# EAGLE design mason (EAGLE 5.10)
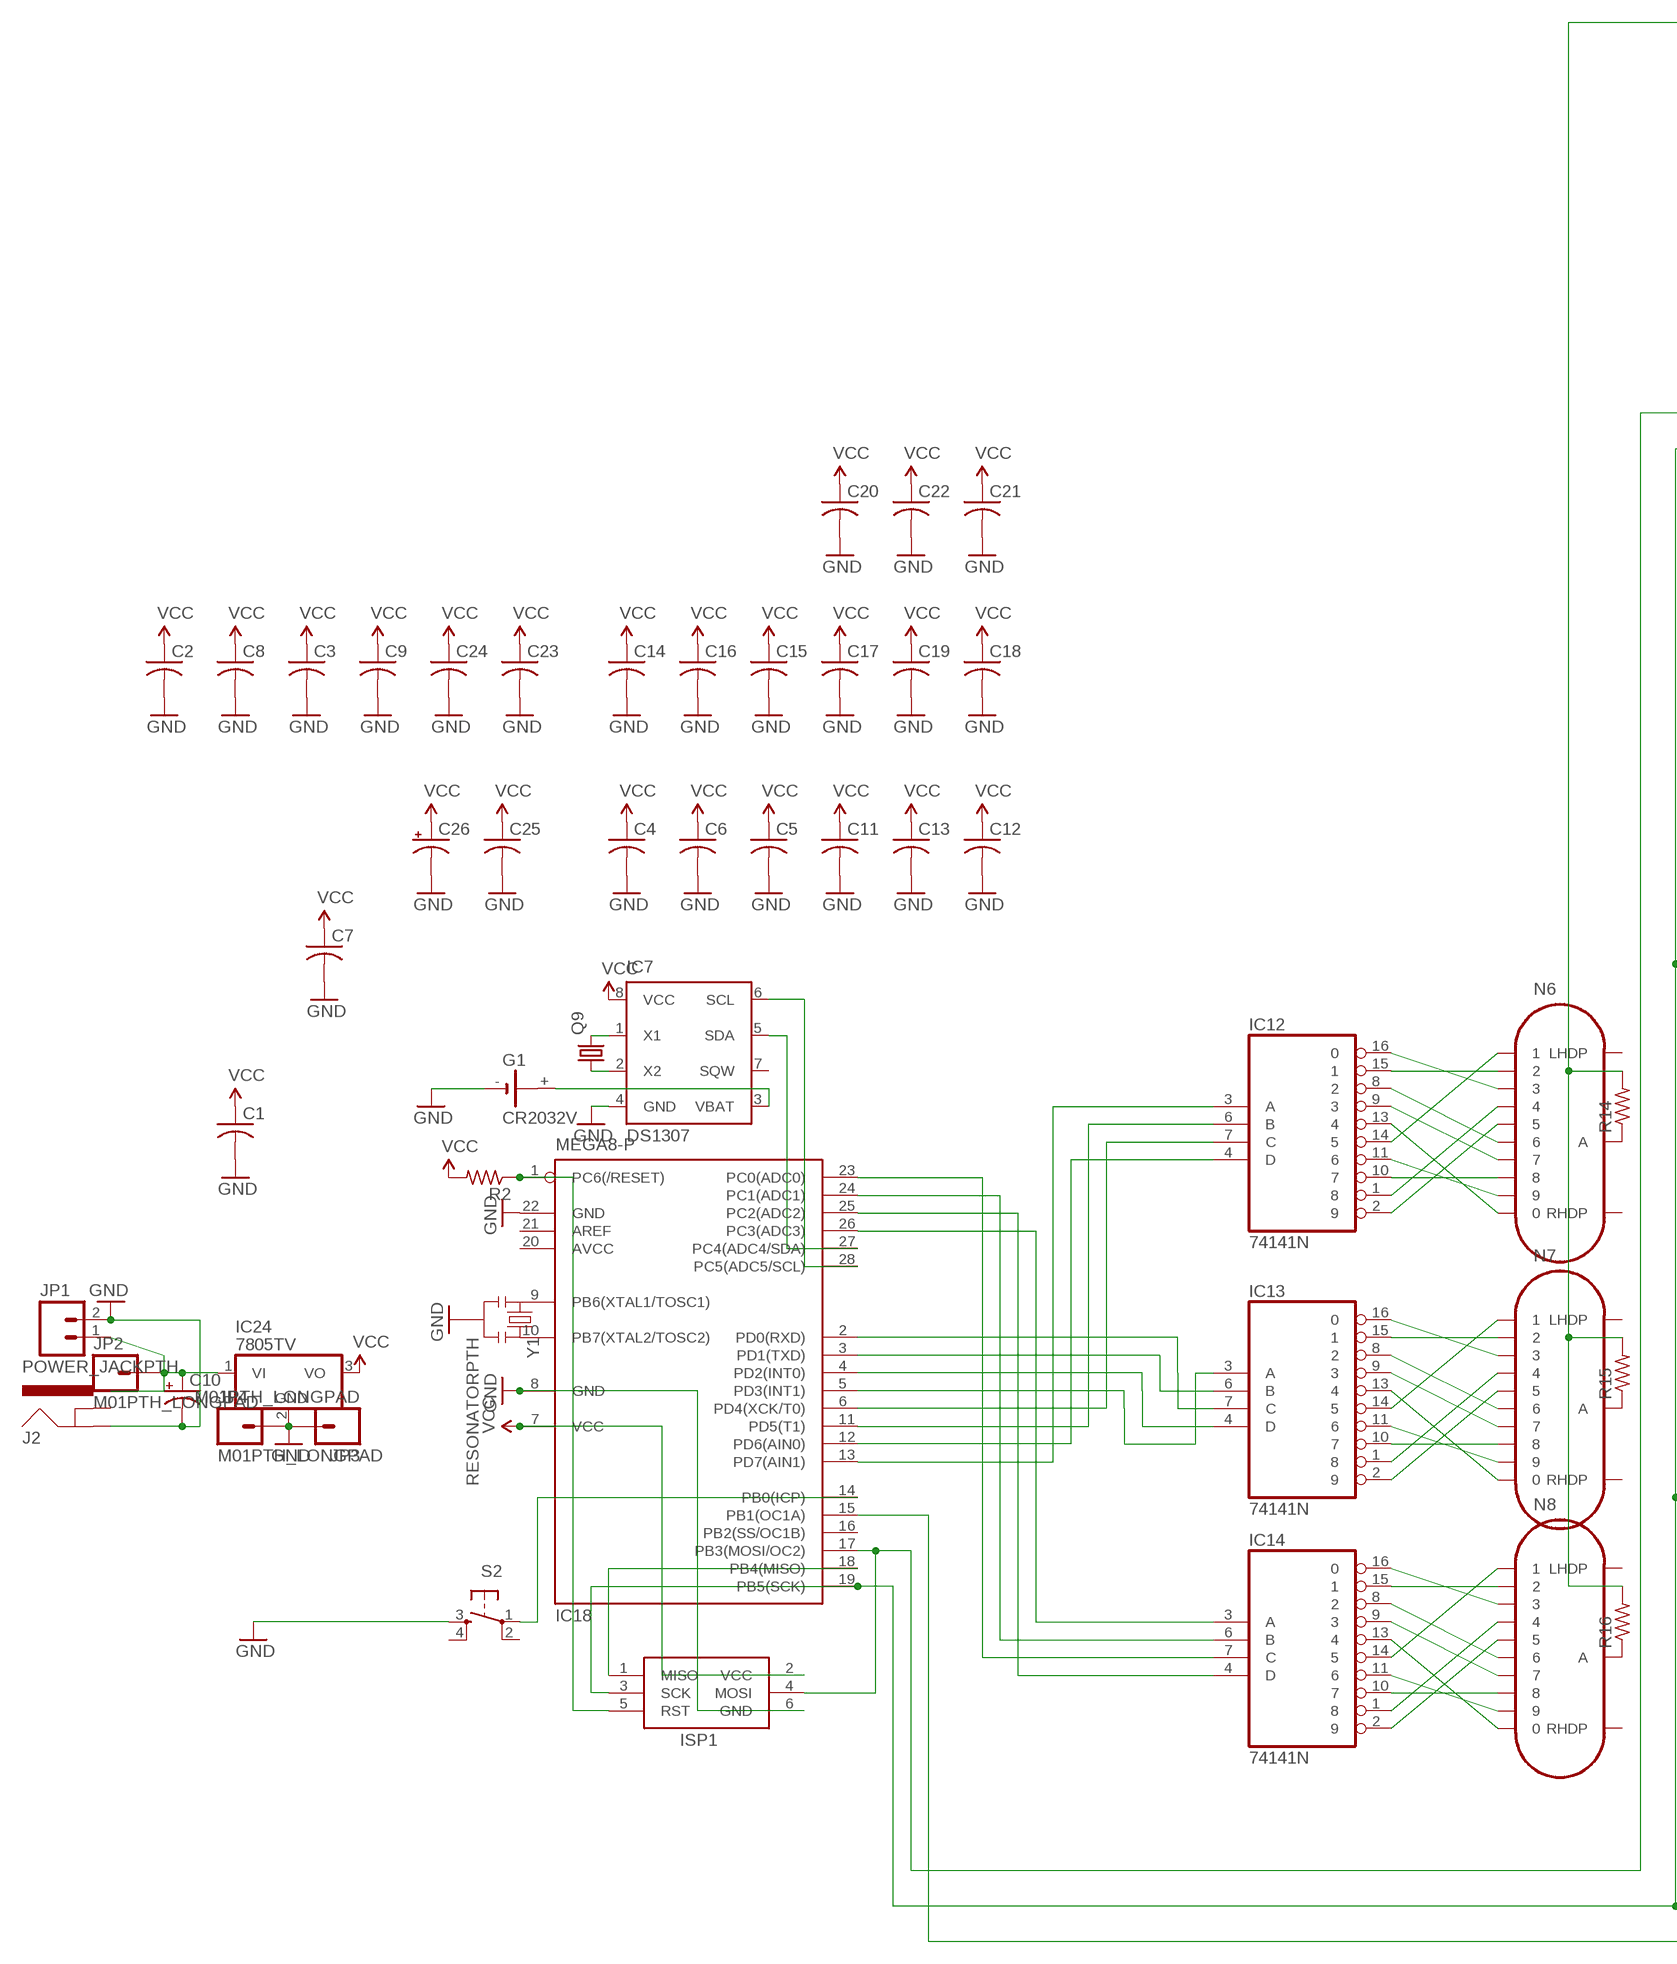
[diagram p0: schematic, sheet 1, part 1 of 2]
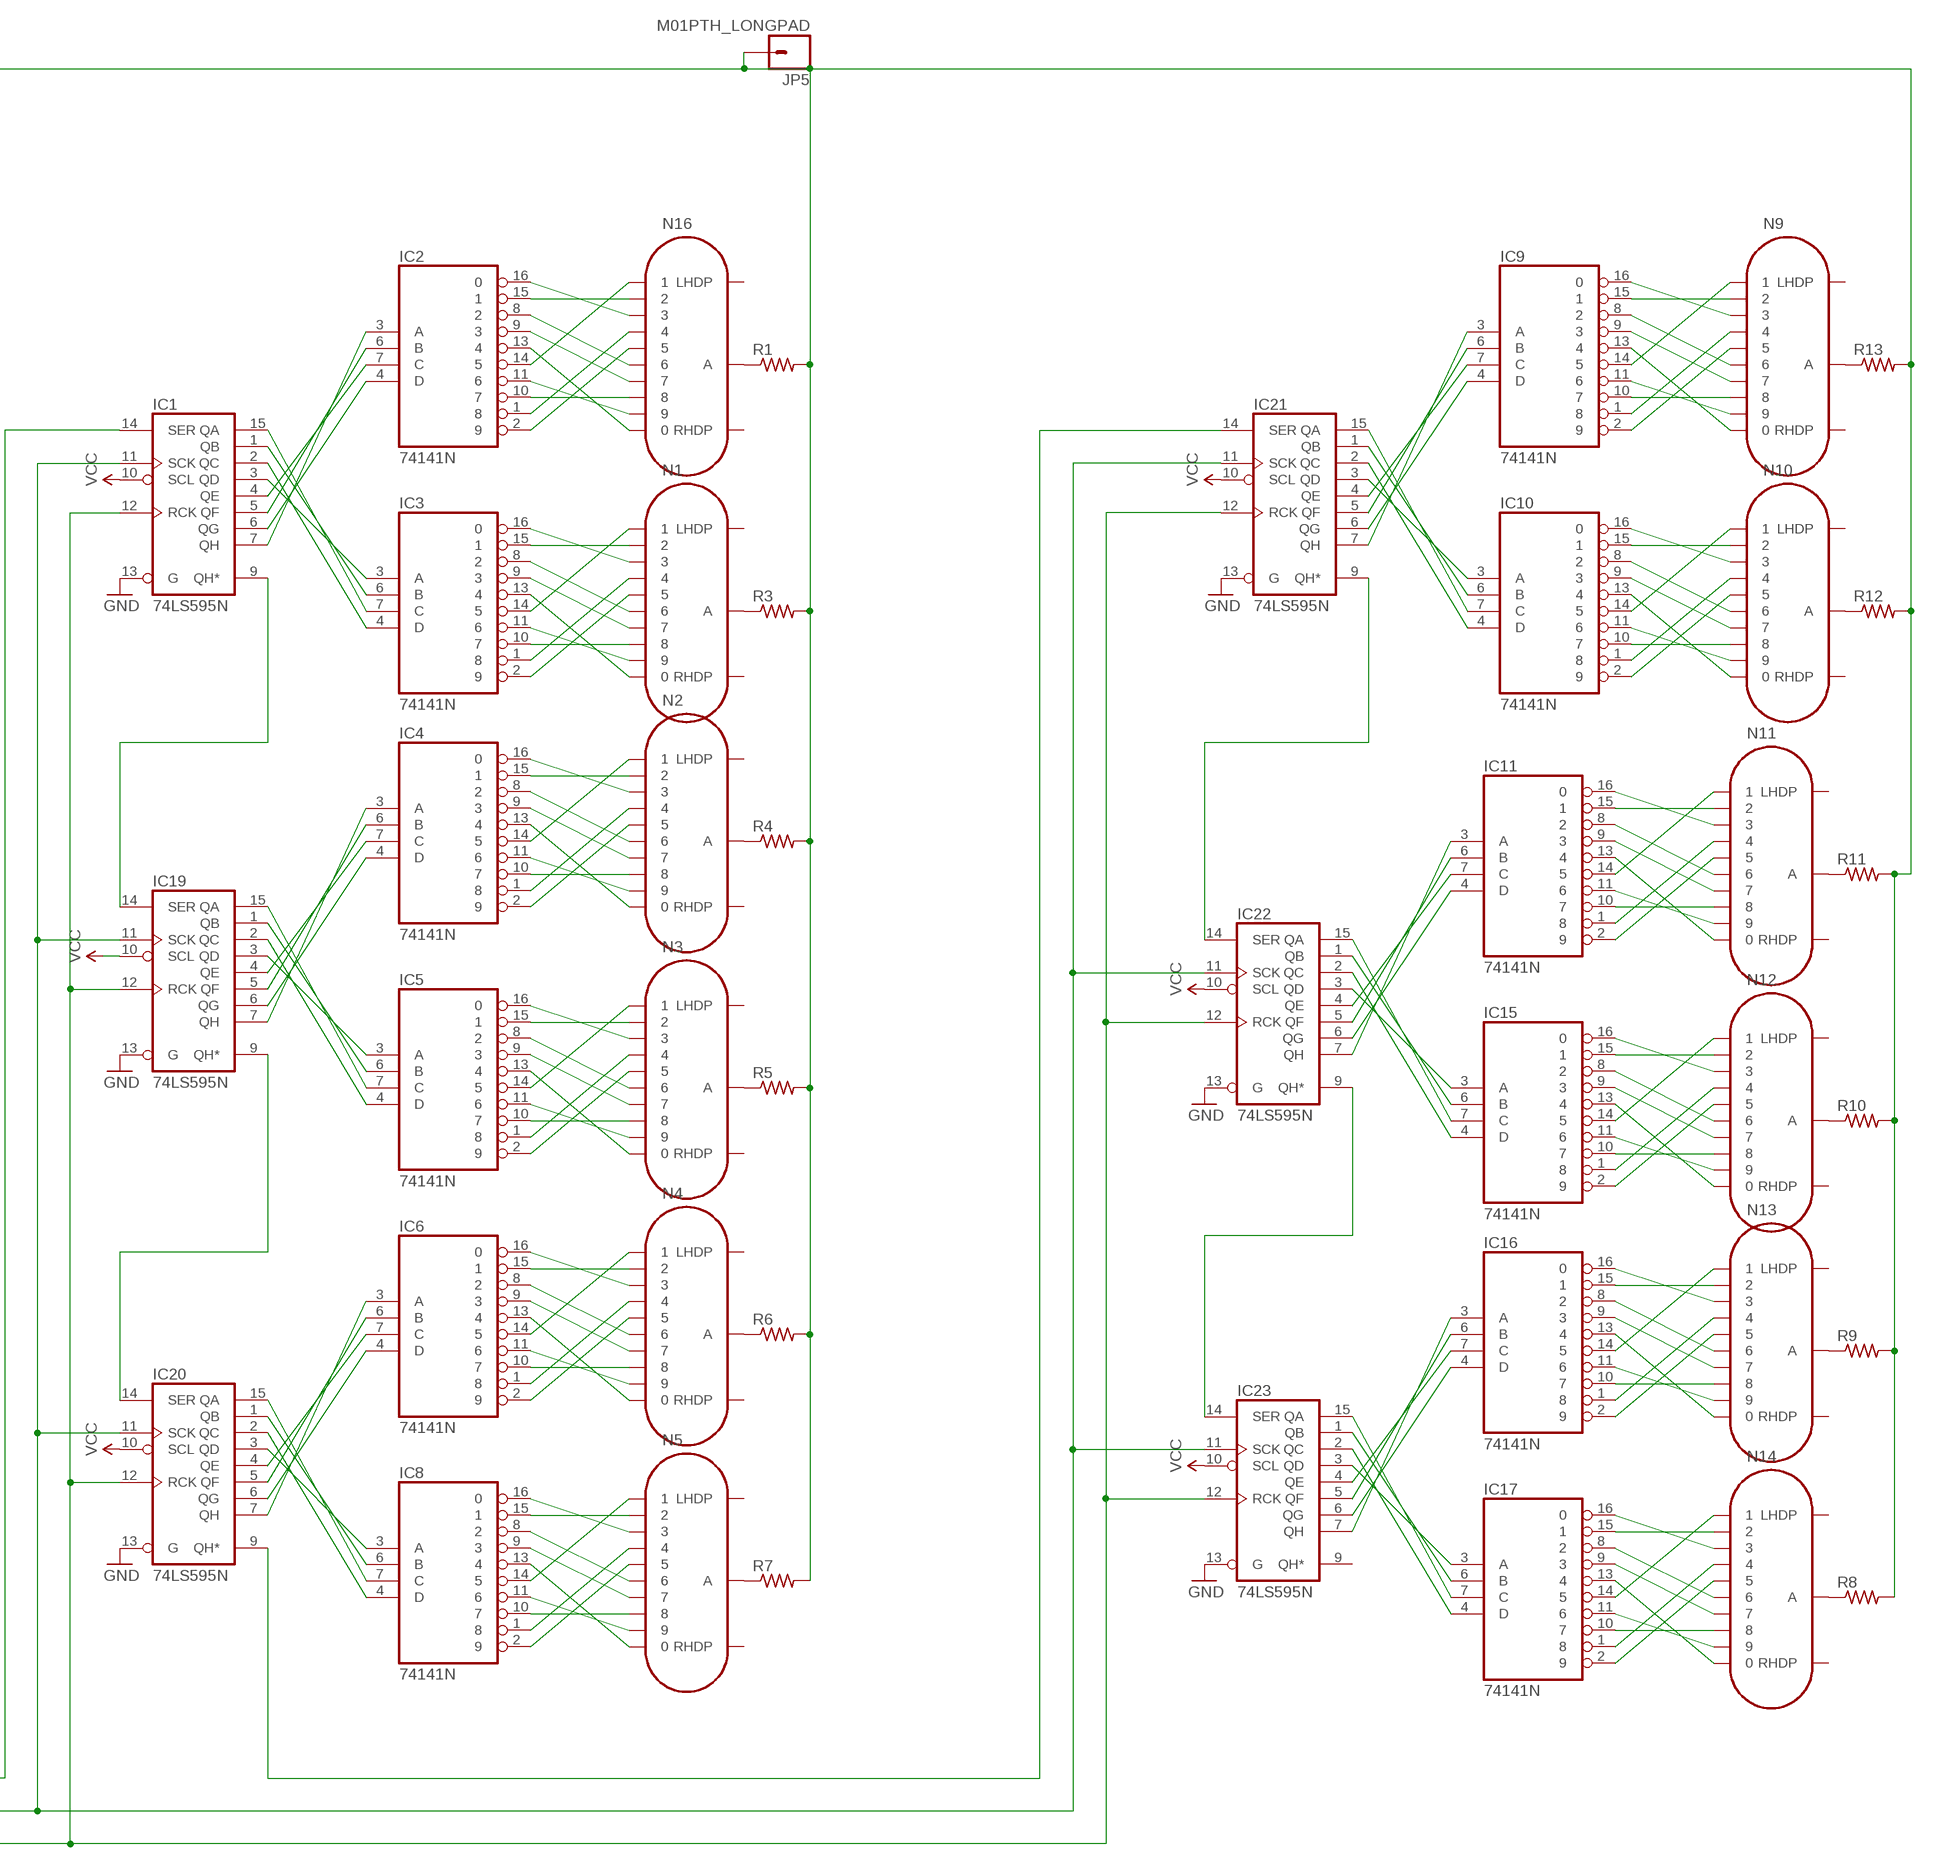
[diagram p1: schematic, sheet 1, part 2 of 2]

## Parts
C1  C-US025-025X050  [C025-025X050]
C2  C-US025-025X050  [C025-025X050]
C3  C-US025-025X050  [C025-025X050]
C4  C-US025-025X050  [C025-025X050]
C5  C-US025-025X050  [C025-025X050]
C6  C-US025-025X050  [C025-025X050]
C7  C-US025-025X050  [C025-025X050]
C8  C-US025-025X050  [C025-025X050]
C9  C-US025-025X050  [C025-025X050]
C10  CPOL-USE3.5-8  [E3,5-8]
C11  C-US025-025X050  [C025-025X050]
C12  C-US025-025X050  [C025-025X050]
C13  C-US025-025X050  [C025-025X050]
C14  C-US025-025X050  [C025-025X050]
C15  C-US025-025X050  [C025-025X050]
C16  C-US025-025X050  [C025-025X050]
C17  C-US025-025X050  [C025-025X050]
C18  C-US025-025X050  [C025-025X050]
C19  C-US025-025X050  [C025-025X050]
C20  C-US025-025X050  [C025-025X050]
C21  C-US025-025X050  [C025-025X050]
C22  C-US025-025X050  [C025-025X050]
C23  C-US025-025X050  [C025-025X050]
C24  C-US025-025X050  [C025-025X050]
C25  C-US025-025X050  [C025-025X050]
C26  CPOL-USE3.5-8  [E3,5-8]
G1  CR2032V  [CR2032V]
IC1  74LS595N  [DIL16]
IC2  74141N  [DIL16]
IC3  74141N  [DIL16]
IC4  74141N  [DIL16]
IC5  74141N  [DIL16]
IC6  74141N  [DIL16]
IC7  DS1307  [DIL08]
IC8  74141N  [DIL16]
IC9  74141N  [DIL16]
IC10  74141N  [DIL16]
IC11  74141N  [DIL16]
IC12  74141N  [DIL16]
IC13  74141N  [DIL16]
IC14  74141N  [DIL16]
IC15  74141N  [DIL16]
IC16  74141N  [DIL16]
IC17  74141N  [DIL16]
IC18  MEGA8-P  [DIL28-3]
IC19  74LS595N  [DIL16]
IC20  74LS595N  [DIL16]
IC21  74LS595N  [DIL16]
IC22  74LS595N  [DIL16]
IC23  74LS595N  [DIL16]
IC24  7805TV  [TO220V]
ISP1  AVRISP-6  [AVRISP]
J2  POWER_JACKPTH  [POWER_JACK_PTH]
JP1  M02  [1X02_LONGPADS]
JP2  M01PTH_LONGPAD  [1X01_LONGPAD]
JP3  M01PTH_LONGPAD  [1X01_LONGPAD]
JP4  M01PTH_LONGPAD  [1X01_LONGPAD]
JP5  M01PTH_LONGPAD  [1X01_LONGPAD]
N1  IN-14  [IN-14]
N2  IN-14  [IN-14]
N3  IN-14  [IN-14]
N4  IN-14  [IN-14]
N5  IN-14  [IN-14]
N6  IN-14  [IN-14]
N7  IN-14  [IN-14]
N8  IN-14  [IN-14]
N9  IN-14  [IN-14]
N10  IN-14  [IN-14]
N11  IN-14  [IN-14]
N12  IN-14  [IN-14]
N13  IN-14  [IN-14]
N14  IN-14  [IN-14]
N16  IN-14  [IN-14]
Q9  CRYSTALTC26H  [TC26H]
R1  R-US_0309/12  [0309/12]
R2  R-US_0204/5  [0204/5]
R3  R-US_0309/12  [0309/12]
R4  R-US_0309/12  [0309/12]
R5  R-US_0309/12  [0309/12]
R6  R-US_0309/12  [0309/12]
R7  R-US_0309/12  [0309/12]
R8  R-US_0309/12  [0309/12]
R9  R-US_0309/12  [0309/12]
R10  R-US_0309/12  [0309/12]
R11  R-US_0309/12  [0309/12]
R12  R-US_0309/12  [0309/12]
R13  R-US_0309/12  [0309/12]
R14  R-US_0309/12  [0309/12]
R15  R-US_0309/12  [0309/12]
R16  R-US_0309/12  [0309/12]
S2  TAC_SWITCHPTH  [TACTILE-PTH]
Y1  RESONATORPTH  [RESONATOR-PTH]

## Nets
GND: C1.2 C2.2 C3.2 C4.2 C5.2 C6.2 C7.2 C8.2 C9.2 C10.- C11.2 C12.2 C13.2 C14.2 C15.2 C16.2 C17.2 C18.2 C19.2 C20.2 C21.2 C22.2 C23.2 C24.2 C25.2 C26.- G1.- IC1.13(G) IC7.4(GND) IC18.8(GND) IC18.22(GND) IC19.13(G) IC20.13(G) IC21.13(G) IC22.13(G) IC23.13(G) IC24.2(GND) ISP1.6(GND) J2.GND JP1.2 JP3.1 JP4.1 S2.3 Y1.2
N$1: IC3.2 N1.5
N$2: IC3.1 N1.4
N$3: IC3.16 N1.3
N$4: IC1.14(SER) IC18.17(PB3(MOSI/OC2)) ISP1.4(MOSI)
N$5: IC3.15 N1.2
N$6: IC3.14 N1.1
N$7: IC3.13 N1.0
N$8: IC3.11 N1.9
N$9: IC3.10 N1.8
N$10: IC3.9 N1.7
N$11: IC4.2 N2.5
N$12: IC4.1 N2.4
N$13: IC4.16 N2.3
N$14: IC2.2 N16.5
N$15: IC18.18(PB4(MISO)) ISP1.1(MISO)
N$16: IC4.15 N2.2
N$17: IC4.14 N2.1
N$18: IC4.13 N2.0
N$19: IC4.11 N2.9
N$20: IC4.10 N2.8
N$21: IC4.9 N2.7
N$22: IC4.8 N2.6
N$23: IC5.2 N3.5
N$24: IC5.1 N3.4
N$25: IC5.16 N3.3
N$26: IC5.15 N3.2
N$27: IC5.14 N3.1
N$28: IC5.13 N3.0
N$29: IC5.11 N3.9
N$30: IC5.10 N3.8
N$31: IC5.9 N3.7
N$32: IC5.8 N3.6
N$33: IC5.7(C) IC19.15(QA)
N$34: IC5.6(B) IC19.1(QB)
N$35: IC5.4(D) IC19.2(QC)
N$36: IC5.3(A) IC19.3(QD)
N$37: IC4.7(C) IC19.4(QE)
N$38: IC4.6(B) IC19.5(QF)
N$39: IC4.4(D) IC19.6(QG)
N$40: IC4.3(A) IC19.7(QH)
N$41: IC6.2 N4.5
N$42: IC6.1 N4.4
N$43: IC6.16 N4.3
N$44: IC14.3(A) IC18.26(PC3(ADC3))
N$45: IC18.10(PB7(XTAL2/TOSC2)) Y1.3
N$46: IC6.15 N4.2
N$47: IC18.9(PB6(XTAL1/TOSC1)) Y1.1
N$48: IC6.14 N4.1
N$49: IC7.5(SDA) IC18.27(PC4(ADC4/SDA))
N$50: IC7.6(SCL) IC18.28(PC5(ADC5/SCL))
N$51: G1.+ IC7.3(VBAT)
N$52: IC7.1(X1) Q9.2
N$53: IC7.2(X2) Q9.1
N$54: IC6.13 N4.0
N$55: IC6.11 N4.9
N$56: IC6.10 N4.8
N$57: IC18.1(PC6(/RESET)) ISP1.5(RST) R2.1
N$58: IC6.9 N4.7
N$59: IC6.8 N4.6
N$60: IC8.2 N5.5
N$61: IC8.1 N5.4
N$62: IC8.16 N5.3
N$63: IC8.15 N5.2
N$64: IC8.14 N5.1
N$65: IC8.13 N5.0
N$66: IC8.11 N5.9
N$67: IC8.10 N5.8
N$68: IC8.9 N5.7
N$69: IC8.8 N5.6
N$70: IC8.7(C) IC20.15(QA)
N$71: IC8.6(B) IC20.1(QB)
N$72: IC8.4(D) IC20.2(QC)
N$73: IC8.3(A) IC20.3(QD)
N$74: IC6.7(C) IC20.4(QE)
N$75: IC6.6(B) IC20.5(QF)
N$76: IC6.4(D) IC20.6(QG)
N$77: IC6.3(A) IC20.7(QH)
N$78: IC9.2 N9.5
N$79: IC9.1 N9.4
N$80: IC9.16 N9.3
N$81: IC9.15 N9.2
N$82: IC9.14 N9.1
N$83: IC9.13 N9.0
N$84: IC9.11 N9.9
N$85: IC12.2 N6.5
N$86: IC12.1 N6.4
N$87: IC12.16 N6.3
N$88: IC12.15 N6.2
N$89: IC12.14 N6.1
N$90: IC12.13 N6.0
N$91: IC12.11 N6.9
N$92: IC12.10 N6.8
N$93: IC12.9 N6.7
N$94: IC12.8 N6.6
N$95: IC13.2 N7.5
N$96: IC13.1 N7.4
N$97: IC13.16 N7.3
N$98: IC13.15 N7.2
N$99: IC13.14 N7.1
N$100: IC13.13 N7.0
N$101: IC13.11 N7.9
N$102: IC13.10 N7.8
N$103: IC13.9 N7.7
N$104: IC13.8 N7.6
N$105: IC14.2 N8.5
N$106: IC14.1 N8.4
N$107: IC14.16 N8.3
N$108: IC14.15 N8.2
N$109: IC14.14 N8.1
N$110: IC14.13 N8.0
N$111: IC14.11 N8.9
N$112: IC9.10 N9.8
N$113: IC9.9 N9.7
N$114: IC9.8 N9.6
N$115: IC10.2 N10.5
N$116: IC10.1 N10.4
N$117: IC10.16 N10.3
N$118: IC10.15 N10.2
N$119: IC10.14 N10.1
N$120: IC10.13 N10.0
N$121: IC10.11 N10.9
N$122: IC10.10 N10.8
N$123: IC10.9 N10.7
N$124: IC10.8 N10.6
N$125: IC10.7(C) IC21.15(QA)
N$126: IC10.6(B) IC21.1(QB)
N$127: IC10.4(D) IC21.2(QC)
N$128: IC10.3(A) IC21.3(QD)
N$129: IC9.7(C) IC21.4(QE)
N$130: IC9.6(B) IC21.5(QF)
N$131: IC9.4(D) IC21.6(QG)
N$132: IC9.3(A) IC21.7(QH)
N$133: IC11.2 N11.5
N$134: IC11.1 N11.4
N$135: IC11.16 N11.3
N$136: IC11.15 N11.2
N$137: IC11.14 N11.1
N$138: IC11.13 N11.0
N$139: IC2.1 N16.4
N$140: IC2.16 N16.3
N$141: IC2.15 N16.2
N$142: IC2.14 N16.1
N$143: IC2.13 N16.0
N$144: IC2.11 N16.9
N$145: IC2.10 N16.8
N$146: IC2.9 N16.7
N$147: IC2.8 N16.6
N$148: IC3.8 N1.6
N$149: IC1.15(QA) IC3.7(C)
N$150: IC11.11 N11.9
N$151: IC11.10 N11.8
N$152: IC11.9 N11.7
N$153: IC11.8 N11.6
N$154: IC14.10 N8.8
N$155: IC14.9 N8.7
N$156: IC14.8 N8.6
N$157: IC15.2 N12.5
N$158: IC15.1 N12.4
N$159: IC15.16 N12.3
N$160: IC15.15 N12.2
N$161: IC15.14 N12.1
N$162: IC15.13 N12.0
N$163: IC14.4(D) IC18.25(PC2(ADC2))
N$164: IC14.6(B) IC18.24(PC1(ADC1))
N$165: IC14.7(C) IC18.23(PC0(ADC0))
N$166: IC13.7(C) IC18.2(PD0(RXD))
N$167: IC13.6(B) IC18.3(PD1(TXD))
N$168: IC13.4(D) IC18.4(PD2(INT0))
N$169: IC13.3(A) IC18.5(PD3(INT1))
N$170: IC12.7(C) IC18.6(PD4(XCK/T0))
N$171: IC12.6(B) IC18.11(PD5(T1))
N$172: IC12.4(D) IC18.12(PD6(AIN0))
N$173: IC12.3(A) IC18.13(PD7(AIN1))
N$174: IC18.14(PB0(ICP)) S2.1
N$175: IC15.11 N12.9
N$176: IC15.10 N12.8
N$177: IC15.9 N12.7
N$178: IC15.8 N12.6
N$179: IC15.7(C) IC22.15(QA)
N$180: IC15.6(B) IC22.1(QB)
N$181: IC15.4(D) IC22.2(QC)
N$182: IC15.3(A) IC22.3(QD)
N$183: IC11.7(C) IC22.4(QE)
N$184: IC11.6(B) IC22.5(QF)
N$185: IC11.4(D) IC22.6(QG)
N$186: IC11.3(A) IC22.7(QH)
N$187: IC16.2 N13.5
N$188: IC16.1 N13.4
N$189: IC16.16 N13.3
N$190: IC16.15 N13.2
N$191: IC16.14 N13.1
N$192: IC16.13 N13.0
N$193: IC16.11 N13.9
N$194: IC16.10 N13.8
N$195: IC16.9 N13.7
N$196: IC16.8 N13.6
N$197: IC17.2 N14.5
N$198: IC17.1 N14.4
N$199: IC17.16 N14.3
N$200: IC17.15 N14.2
N$201: IC17.14 N14.1
N$202: IC17.13 N14.0
N$203: IC17.11 N14.9
N$204: IC17.10 N14.8
N$205: IC17.9 N14.7
N$206: IC17.8 N14.6
N$207: IC17.7(C) IC23.15(QA)
N$208: IC17.6(B) IC23.1(QB)
N$209: IC17.4(D) IC23.2(QC)
N$210: IC17.3(A) IC23.3(QD)
N$211: IC16.7(C) IC23.4(QE)
N$212: IC16.6(B) IC23.5(QF)
N$213: IC16.4(D) IC23.6(QG)
N$214: IC16.3(A) IC23.7(QH)
N$215: IC1.1(QB) IC3.6(B)
N$216: IC1.2(QC) IC3.4(D)
N$217: IC1.3(QD) IC3.3(A)
N$218: IC1.4(QE) IC2.7(C)
N$219: IC1.5(QF) IC2.6(B)
N$220: IC1.6(QG) IC2.4(D)
N$221: IC1.7(QH) IC2.3(A)
N$222: C10.+ IC24.1(VI) J2.PWR JP1.1 JP2.1
N$223: IC1.9(QH*) IC19.14(SER)
N$224: IC19.9(QH*) IC20.14(SER)
N$225: IC20.9(QH*) IC21.14(SER)
N$226: IC21.9(QH*) IC22.14(SER)
N$227: IC22.9(QH*) IC23.14(SER)
N$228: IC1.11(SCK) IC18.19(PB5(SCK)) IC19.11(SCK) IC20.11(SCK) IC21.11(SCK) IC22.11(SCK) IC23.11(SCK) ISP1.3(SCK)
N$229: IC1.12(RCK) IC18.15(PB1(OC1A)) IC19.12(RCK) IC20.12(RCK) IC21.12(RCK) IC22.12(RCK) IC23.12(RCK)
N$230: N16.A R1.1
N$231: N1.A R3.1
N$232: N2.A R4.1
N$233: N3.A R5.1
N$234: N4.A R6.1
N$235: N5.A R7.1
N$236: N14.A R8.1
N$237: N13.A R9.1
N$238: N12.A R10.1
N$239: N11.A R11.1
N$240: N10.A R12.1
N$241: N9.A R13.1
N$242: N6.A R14.1
N$243: N7.A R15.1
N$244: N8.A R16.1
N$245: JP5.1 R1.2 R3.2 R4.2 R5.2 R6.2 R7.2 R8.2 R9.2 R10.2 R11.2 R12.2 R13.2 R14.2 R15.2 R16.2
VCC: C1.1 C2.1 C3.1 C4.1 C5.1 C6.1 C7.1 C8.1 C9.1 C11.1 C12.1 C13.1 C14.1 C15.1 C16.1 C17.1 C18.1 C19.1 C20.1 C21.1 C22.1 C23.1 C24.1 C25.1 C26.+ IC1.10(SCL) IC7.8(VCC) IC18.7(VCC) IC19.10(SCL) IC20.10(SCL) IC21.10(SCL) IC22.10(SCL) IC23.10(SCL) IC24.3(VO) ISP1.2(VCC) R2.2
Unconnected: G1.+@1(+) IC7.7(SQW) IC18.16(PB2(SS/OC1B)) IC18.21(AREF) IC23.9(QH*) J2.GNDBREAK N1.LHDP N1.RHDP N2.LHDP N2.RHDP N3.LHDP N3.RHDP N4.LHDP N4.RHDP N5.LHDP N5.RHDP N6.LHDP N6.RHDP N7.LHDP N7.RHDP N8.LHDP N8.RHDP N9.LHDP N9.RHDP N10.LHDP N10.RHDP N11.LHDP N11.RHDP N12.LHDP N12.RHDP N13.LHDP N13.RHDP N14.LHDP N14.RHDP N16.LHDP N16.RHDP S2.2 S2.4

## Power pins joined to a net without a drawn wire
AVCC: IC18.20(AVCC)
GND: IC1.8(GND) IC2.12(GND) IC3.12(GND) IC4.12(GND) IC5.12(GND) IC6.12(GND) IC8.12(GND) IC9.12(GND) IC10.12(GND) IC11.12(GND) IC12.12(GND) IC13.12(GND) IC14.12(GND) IC15.12(GND) IC16.12(GND) IC17.12(GND) IC19.8(GND) IC20.8(GND) IC21.8(GND) IC22.8(GND) IC23.8(GND)
VCC: IC1.16(VCC) IC2.5(VCC) IC3.5(VCC) IC4.5(VCC) IC5.5(VCC) IC6.5(VCC) IC8.5(VCC) IC9.5(VCC) IC10.5(VCC) IC11.5(VCC) IC12.5(VCC) IC13.5(VCC) IC14.5(VCC) IC15.5(VCC) IC16.5(VCC) IC17.5(VCC) IC19.16(VCC) IC20.16(VCC) IC21.16(VCC) IC22.16(VCC) IC23.16(VCC)

## Library data of the parts
C1-C9 C11-C25 = rcl:C-US: CAPACITOR, American symbol
C10 C26 = rcl:CPOL-US: POLARIZED CAPACITOR, American symbol
G1 = battery:CR2032V: LI BATTERY Varta
IC1 IC19-IC23 = 74xx-us:74*595: 8-bit SHIFT REGISTER, output latch
IC2-IC6 IC8-IC17 = 74xx-us:74*141: BCD to decimal DECODER/DRIVER
IC7 = ds1307_pcf8583:DS1307: I2C-Bus CLOCK/CALENDAR
IC18 = atmel:MEGA8-P: MICROCONTROLLER 8 Kbytes FLASH, 1 kbytes SRAM, 512 bytes EEPROM, USART, 4-channel 10 bit ADC, 2-channel 8 bit ADC Pin compatible with Atmega48, ATMega88, ATMega168 Source: avr.lbr
IC24 = linear:78*: Positive VOLTAGE REGULATOR Source: http://cache.national.com/ds/LM/LM78L05.pdf http://www.fairchildsemi.com/ds/LM/LM7805.pdf
ISP1 = adafruit:AVRISP: AVR ISP HEADER Standard 6 pin header for AVR programming
J2 = SparkFun:POWER_JACK: Power Jack This is the standard 5.5mm barrel jack for power. The PTH is the most common, proven, reliable, footprint. All others are experimental. The Slot footprint only works if the mill layer is transmitted to the PCB fab house so be warned. Spark Fun Electronics SKU : PRT-00119. Mating wall wart : TOL-00298 (and others)
JP1 = SparkFun:M02: Header 2 Standard 2-pin 0.1" header. Use with straight break away headers (SKU : PRT-00116), right angle break away headers (PRT-00553), swiss pins (PRT-00743), machine pins (PRT-00117), and female headers (PRT-00115). Molex polarized connector foot print use with SKU : PRT-08233 with associated crimp pins and housings.
JP2-JP5 = SparkFun:M01: Header 1 Standard 1-pin 0.1" header. Use with straight break away headers (SKU : PRT-00116), right angle break away headers (PRT-00553), swiss pins (PRT-00743), machine pins (PRT-00117), and female headers (PRT-00115).
N1-N14 N16 = russian-nixies:IN-14: IN-14: medium numeric frontview nixie tube
Q9 = crystal:CRYSTAL: CRYSTAL
R1 R3-R16 = resistor:R-US_: RESISTOR, American symbol
R2 = rcl:R-US_: RESISTOR, American symbol
S2 = SparkFun:TAC_SWITCH: Momentary Switch Button commonly used for reset or general input. Spark Fun Electronics SKU : COM-00097
Y1 = SparkFun:RESONATOR: Resonator Small SMD resonator. This is the itty bitty 10/20MHz resonators with built in caps. CSTCE10M0G55 and CSTCE20M0V53. Footprint has been reviewed closely but hasn't been tested yet.

## Board
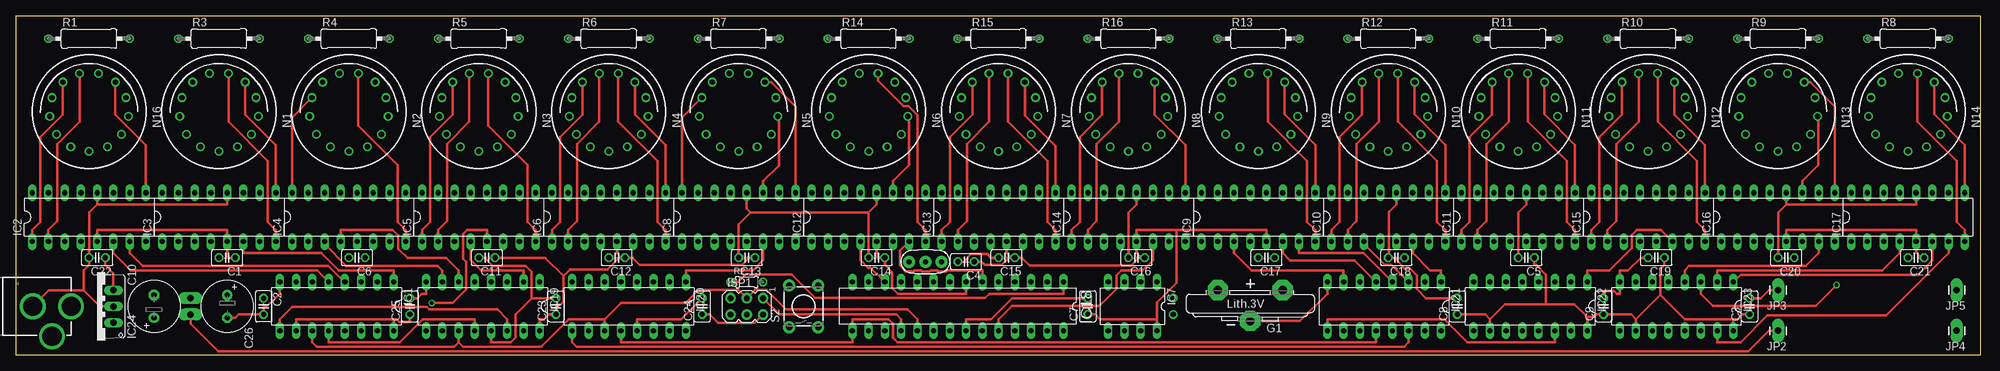
[diagram p2: board, top side]
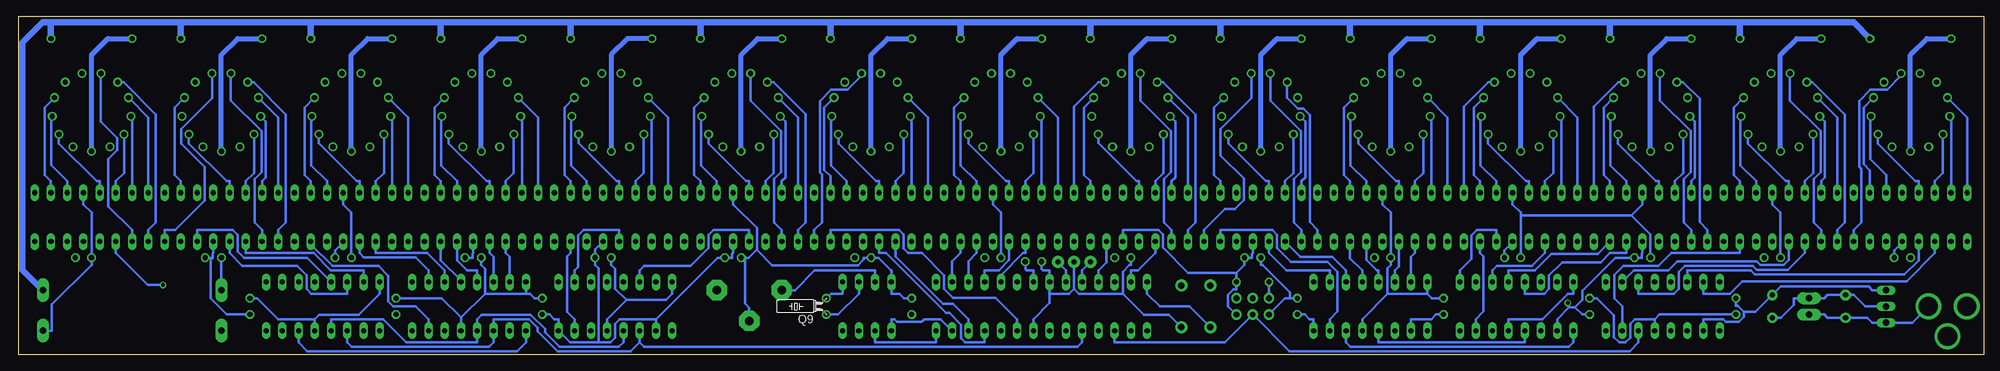
[diagram p3: board, bottom side, seen from below]

Size 307.32 x 53.01 mm. Coordinates in mm from the lower left corner, seen from the top.
Outline: 0,0 307.32,0 307.32,53.01 0,53.01 0,0
Copper layers (1*16): Top 0.035mm / dielectric 1.5mm / Bottom 0.035mm
Design rules "default *": minimum track width 15mil, minimum drill 24mil, track to track 12mil, track to pad 12mil, pad to pad 12mil, via to via 12mil, smd to smd 8mil, copper to edge 40mil, drill to drill 8mil, minimum pad ring 10mil, minimum via ring 8mil, stop-mask expansion 4mil, vias tented up to drill 0mil, thermal gap 10mil

### Footprints (pad centres in the part's own frame; a part is rotated, then mirrored left to right if it is on the bottom)
C025-025X050 = drill 0.813 octagon: 1 -1.27,0; 2 1.27,0
E3,5-8 = drill 0.813 pad 1.6 round: + -1.778,0 | drill 0.813 pad 1.6 octagon: - 1.778,0
CR2032V = drill 1.321 pad 3.15 octagon: + -2.54,-5.08; +@1 -2.54,5.08; - 2.286,0
DIL16 = drill 0.813 long: 1 -8.89,-3.81; 2 -6.35,-3.81; 3 -3.81,-3.81; 4 -1.27,-3.81; 5 1.27,-3.81; 6 3.81,-3.81; 7 6.35,-3.81; 8 8.89,-3.81; 9 8.89,3.81; 10 6.35,3.81; 11 3.81,3.81; 12 1.27,3.81; 13 -1.27,3.81; 14 -3.81,3.81; 15 -6.35,3.81; 16 -8.89,3.81
DIL08 = drill 0.813 long: 1 -3.81,-3.81; 2 -1.27,-3.81; 3 1.27,-3.81; 4 3.81,-3.81; 5 3.81,3.81; 6 1.27,3.81; 7 -1.27,3.81; 8 -3.81,3.81
DIL28-3 = drill 0.813 long: 1 -16.51,-3.81; 2 -13.97,-3.81; 3 -11.43,-3.81; 4 -8.89,-3.81; 5 -6.35,-3.81; 6 -3.81,-3.81; 7 -1.27,-3.81; 8 1.27,-3.81; 9 3.81,-3.81; 10 6.35,-3.81; 11 8.89,-3.81; 12 11.43,-3.81; 13 13.97,-3.81; 14 16.51,-3.81; 15 16.51,3.81; 16 13.97,3.81; 17 11.43,3.81; 18 8.89,3.81; 19 6.35,3.81; 20 3.81,3.81; 21 1.27,3.81; 22 -1.27,3.81; 23 -3.81,3.81; 24 -6.35,3.81; 25 -8.89,3.81; 26 -11.43,3.81; 27 -13.97,3.81; 28 -16.51,3.81
TO220V = drill 1.016 long: 1 -2.54,-2.54; 2 0,-2.54; 3 2.54,-2.54
AVRISP = drill 0.9 pad 1.626 round: 1 -1.27,2.54; 2 1.27,2.54; 3 -1.27,0; 4 1.27,0; 5 -1.27,-2.54; 6 1.27,-2.54
POWER_JACK_PTH = drill 2.997 round: GND 0,7.7; GNDBREAK 4.7,10.7; PWR 0,13.7
1X02_LONGPADS = drill 1.016 pad 1.88 long: 1 0,0; 2 2.54,0
1X01_LONGPAD = drill 1.016 pad 1.88 long: 1 0,0
IN-14 = drill 0.84 round: 0 5.094,-3.516; 1 -5.094,-3.516; 2 -6.145,-0.746; 3 -5.788,2.195; 4 -4.105,4.633; 5 -1.481,6.01; 6 1.481,6.01; 7 4.105,4.633; 8 5.788,2.195; 9 6.145,-0.746; A 0,-6.19; LHDP 2.877,-5.481; RHDP -2.877,-5.481
TC26H = drill 0.813 round: 1 -1.27,0; 2 1.27,0
0309/12 = drill 0.813 octagon: 1 -6.35,0; 2 6.35,0
0204/5 = drill 0.813 octagon: 1 -2.54,0; 2 2.54,0
TACTILE-PTH = drill 1.016 pad 1.88 round: 1 -3.251,2.261; 2 3.251,2.261; 3 -3.251,-2.261; 4 3.251,-2.261
RESONATOR-PTH = drill 0.8 pad 1.88 round: 1 -2.54,0; 2 0,0; 3 2.54,0

### Placement (x,y rotation side)
C1  33.02,15.24 180 top
C2  38.73,7.62 270 top
C3  271.14,7.62 90 top
C4  148.59,14.61 180 top
C5  236.22,15.24 180 top
C6  53.34,15.24 180 top
C7  167.64,7.62 90 top
C8  225.43,7.62 90 top
C9  248.28,7.62 90 top
C10  21.59,7.62 90 top
C11  73.66,15.24 180 top
C12  93.98,15.24 180 top
C13  114.3,15.24 180 top
C14  134.62,15.24 180 top
C15  154.94,15.24 180 top
C16  175.26,15.24 180 top
C17  195.58,15.24 180 top
C18  215.9,15.24 180 top
C19  256.54,15.24 180 top
C20  276.86,15.24 180 top
C21  297.18,15.24 180 top
C22  12.7,15.24 180 top
C23  84.45,7.62 90 top
C24  107.31,7.62 90 top
C25  61.59,7.62 90 top
C26  33.02,7.62 270 top
G1  193.04,7.62 270 top
IC1  50.16,7.62 180 top
IC2  11.43,21.59 0 top
IC3  31.75,21.59 0 top
IC4  52.07,21.59 0 top
IC5  72.39,21.59 0 top
IC6  92.71,21.59 0 top
IC7  174.62,7.62 180 top
IC8  113.03,21.59 0 top
IC9  194.31,21.59 0 top
IC10  214.63,21.59 0 top
IC11  234.95,21.59 0 top
IC12  133.35,21.59 0 top
IC13  153.67,21.59 0 top
IC14  173.99,21.59 0 top
IC15  255.27,21.59 0 top
IC16  275.59,21.59 0 top
IC17  295.91,21.59 0 top
IC18  147.32,7.62 180 top
IC19  73.03,7.62 180 top
IC20  95.89,7.62 180 top
IC21  214,7.62 180 top
IC22  236.85,7.62 180 top
IC23  259.71,7.62 180 top
IC24  12.7,7.62 90 top
ISP1  114.3,7.62 270 top
J2  -5.08,7.62 270 top
JP1  27.3,6.35 90 top
JP2  275.59,3.81 180 top
JP3  275.59,10.16 180 top
JP4  303.53,3.81 180 top
JP5  303.53,10.16 180 top
N1  31.75,38.1 0 top
N2  52.07,38.1 0 top
N3  72.39,38.1 0 top
N4  92.71,38.1 0 top
N5  113.03,38.1 0 top
N6  133.35,38.1 0 top
N7  153.67,38.1 0 top
N8  173.99,38.1 0 top
N9  194.31,38.1 0 top
N10  214.63,38.1 0 top
N11  234.95,38.1 0 top
N12  255.27,38.1 0 top
N13  275.59,38.1 0 top
N14  295.91,38.1 0 top
N16  11.43,38.1 0 top
Q9  180.97,7.62 90 bottom
R1  11.43,49.53 0 top
R2  114.3,11.43 0 top
R3  31.75,49.53 0 top
R4  52.07,49.53 0 top
R5  72.39,49.53 0 top
R6  92.71,49.53 0 top
R7  113.03,49.53 0 top
R8  295.91,49.53 0 top
R9  275.59,49.53 0 top
R10  255.27,49.53 0 top
R11  234.95,49.53 0 top
R12  214.63,49.53 0 top
R13  194.31,49.53 0 top
R14  133.35,49.53 0 top
R15  153.67,49.53 0 top
R16  173.99,49.53 0 top
S2  123.19,7.62 90 top
Y1  142.24,14.61 180 top

### Tracks (layer width: path | path; a pad name or v marks a point on that pad's centre or on a via)
GND
  Top 0.381: IC10.12 215.9,23.58 214.74,22.43 214.74,15.24 | 214.74,15.24 C18.2 | 214.74,15.24 214.86,15.24 215.79,15.24 215.79,14.93 217.17,13.55 218.02,13.55 219.07,12.49 219.07,10.33 220.51,8.89 C8.2 | C15.2 152.51,15.24 151.95,15.81 149.39,15.81 148.48,14.89 148.48,14.61 C4.2 | IC17.12 297.18,23.58 276.86,23.58 | 276.86,23.58 IC16.12 | C20.2 275.59,22.31 276.86,23.58 | IC18.22 148.59,5.63 152.5,5.63 155.77,8.89 166.48,8.89 C7.2 | 114.92,22.31 114.3,22.93 114.3,23.58 IC8.12 | 133.35,22.31 114.92,22.31 | 114.92,22.31 113.03,20.43 C13.2 | 133.35,22.31 134.62,23.58 IC12.12 | C14.2 133.35,22.31 | C25.2 62.75,8.89 63.48,9.61 64.14,9.61 IC19.8 | 12.7,23.58 11.43,22.31 C22.2 11.43,14.66 11.43,14.08 10.57,13.22 10.57,10.12 | C9.2 248.28,10.05 249.91,10.05 250.35,9.61 250.82,9.61 IC23.8 250.82,13.25 252.12,13.25 254.11,15.24 C19.2 | 80.64,8.89 80.64,13.01 79.72,13.93 74.58,13.93 73.55,14.97 73.55,15.24 C11.2 | 80.64,8.89 78.11,6.35 78.11,2.77 77.32,1.99 74.3,1.99 IC19.13 | C23.2 80.64,8.89 | 12.7,23.58 IC2.12 | IC3.12 33.02,23.58 12.7,23.58 | IC20.13 97.16,5.63 104.05,5.63 C24.2 | 10.57,10.12 13.07,7.62 IC24.2 | J2.GND 5.12,10.12 10.57,10.12 | JP3.1 274.15,10.16 272.88,8.89 C3.2 | IC11.12 236.22,23.58 234.95,22.31 C5.2 | IC21.8 205.1,9.61 200.82,5.33 G1.- | IC14.12 175.26,23.58 173.99,22.31 C16.2 | IC1.8 41.27,9.61 39.17,7.51 38.73,7.51 C2.2 34.82,6.35 34.32,5.84 C26.-
  Bottom 0.381: 212.25,8.64 206.08,8.64 205.1,9.61 IC21.8 | 212.25,8.64 215.26,5.63 IC21.13 | 212.25,8.64 214,10.38 214,13.45 214.63,14.08 C18.2 | C7.2 168.8,8.89 169.52,9.61 170.81,9.61 IC7.4 170.81,13.25 170.84,13.25 172.83,15.24 C16.2 175.15,15.24 175.15,14.97 176.05,14.07 189.46,14.07 191.85,16.46 | IC13.12 154.94,23.58 153.67,22.31 C15.2 | 260.99,5.63 260.3,6.31 254.13,6.31 250.82,9.61 IC23.8 | 238.12,5.87 IC22.13 | 238.12,5.87 234.38,9.61 | C9.2 241.15,8.89 238.12,5.87 | 234.38,9.61 234.38,13.52 234.95,14.08 C5.2 | 234.38,9.61 227.97,9.61 | IC18.22 148.59,5.63 146.05,8.17 146.05,9.61 | 142.24,10.39 143.02,9.61 146.05,9.61 | 142.24,10.39 Y1.2 | 134.62,9.61 141.46,9.61 142.24,10.39 | 146.05,9.61 IC18.8 146.05,13.25 147.12,13.25 147.32,13.45 C4.2 | 93.24,9.61 93.24,13.55 92.71,14.08 C12.2 92.71,22.31 93.98,23.58 IC6.12 | 93.24,9.61 87,9.61 | 93.24,9.61 93.24,9.54 97.16,5.63 IC20.13 | C25.2 60.44,8.89 57.78,6.24 57.78,2.75 56.99,1.96 55.99,1.96 55.24,2.71 55.24,4.88 54.5,5.63 51.44,5.63 | IC3.12 33.02,23.58 31.75,22.31 C1.2 | JP4.1 302.1,3.81 302.1,7.9 295.91,14.08 C21.2 295.91,22.31 297.18,23.58 IC17.12 | 134.62,9.61 134.62,13.05 133.59,14.08 133.35,14.08 C14.2 | S2.3 127.39,6.31 131.32,6.31 134.62,9.61 | 55.05,21.87 53.34,23.58 IC4.12 | 72.39,21.87 55.05,21.87 | 55.05,21.87 52.07,18.89 C6.2 | IC5.12 73.66,23.58 72.39,22.31 72.39,21.87 | C11.2 72.39,21.87 | 260.99,5.63 266.73,5.63 269.99,8.89 C3.2 | JP3.1 275.59,12.54 C20.2 | 260.99,5.63 IC23.13 | 227.97,9.61 | 227.97,9.61 227.3,9.61 226.58,8.89 C8.2 | 191.85,16.46 191.93,16.46 193.15,15.24 193.73,15.24 | 191.85,16.46 191.85,19.86 195.58,23.58 IC9.12
  Bottom 0.381: C23.2 86.27,8.89 87,9.61 | 87,9.61 IC20.8 | IC19.8 64.14,9.61 64.97,9.61 68.96,5.63 74.3,5.63 IC19.13 | C26.- 31.72,5.84 29.68,7.89 29.68,8.89 JP1.2 24.93,8.89 24.42,9.4 C10.- 20.29,9.4 18.52,7.62 IC24.2 | 227.97,9.61 IC22.8 | G1.- 193.04,7.4 193.73,8.1 193.73,15.24 | 193.73,15.24 C17.2 | 108.47,8.89 109.22,8.89 ISP1.6 | 108.47,8.89 108.47,9.81 112.74,14.08 113.03,14.08 C13.2 | 108.47,8.89 C24.2 | 51.44,5.63 50.71,6.35 39.89,6.35 C2.2 | C19.2 255.27,22.31 256.54,23.58 IC15.12 | 51.44,5.63 IC1.13
N$1
  Bottom 0.381: N1.5 30.27,39.86 25.49,35.08 25.49,28.63 26.57,27.54 26.57,20.77 25.4,19.6 IC3.2
N$2
  Bottom 0.381: IC3.1 22.86,19.6 21.67,20.79 21.67,37.66 26.74,42.73 N1.4
N$3
  Bottom 0.381: IC3.16 22.86,37.19 N1.3
N$4
  Bottom 0.381: IC1.14 53.98,1.99 55.35,0.62 108.57,0.62 ISP1.4 118.66,1.99 135.89,1.99 IC18.17
N$5
  Bottom 0.381: IC3.15 25.4,27.22 24.8,27.82 24.8,36.55 N1.2
N$6
  Bottom 0.381: IC3.14 27.94,27.22 26.66,28.5 N1.1
N$7
  Bottom 0.381: IC3.13 30.48,27.22 30.96,27.22 36.84,33.1 N1.0
N$8
  Bottom 0.381: IC3.11 35.56,27.22 38.02,29.68 38.02,37.23 N1.9
N$9
  Bottom 0.381: IC3.10 38.1,27.22 39.07,28.19 39.07,38.76 N1.8
N$10
  Top 0.381: N1.7 35.85,37.68 40.64,32.89 IC3.9
N$11
  Bottom 0.381: N2.5 50.59,39.86 45.81,35.08 45.81,28.63 46.89,27.54 46.89,20.77 45.72,19.6 IC4.2
N$12
  Bottom 0.381: IC4.1 43.18,19.6 44.39,20.81 44.39,40.13 47,42.73 N2.4
N$13
  Top 0.381: N2.3 43.18,37.19 IC4.16
N$14
  Top 0.381: IC2.2 5.08,19.6 6.46,20.98 6.46,33.06 9.95,36.54 N16.5
N$15
  Top 0.381: ISP1.1 119.39,6.34 137.72,6.34 138.43,5.63 IC18.18
N$16
  Bottom 0.381: IC4.15 45.72,27.22 45.12,27.82 45.12,36.55 N2.2
N$17
  Bottom 0.381: IC4.14 48.26,27.22 46.98,28.5 N2.1
N$18
  Bottom 0.381: IC4.13 50.8,27.22 51.25,27.22 57.16,33.13 N2.0
N$19
  Bottom 0.381: N2.9 58.37,37.2 58.37,29.71 55.88,27.22 IC4.11
N$20
  Bottom 0.381: IC4.10 58.42,27.22 59.39,28.19 59.39,38.76 N2.8
N$21
  Bottom 0.381: IC4.9 60.96,27.22 60.96,38.91 57.14,42.73 N2.7
N$22
  Top 0.381: IC4.8 60.96,19.6 59.69,20.87 59.69,29.79 53.55,35.92 N2.6
N$23
  Top 0.381: IC5.2 66.04,19.6 67.42,20.98 67.42,33.06 70.91,36.54 N3.5
N$24
  Top 0.381: N3.4 68.28,37.68 64.77,34.16 64.77,20.87 63.5,19.6 IC5.1
N$25
  Bottom 0.381: N3.3 63.5,37.19 IC5.16
N$26
  Bottom 0.381: IC5.15 66.04,27.22 66.04,37.15 N3.2
N$27
  Bottom 0.381: IC5.14 68.58,27.22 67.3,28.5 N3.1
N$28
  Bottom 0.381: IC5.13 71.12,27.22 71.57,27.22 77.48,33.13 N3.0
N$29
  Bottom 0.381: N3.9 78.69,37.2 78.69,29.71 76.2,27.22 IC5.11
N$30
  Bottom 0.381: IC5.10 78.74,27.22 79.71,28.19 79.71,38.76 N3.8
N$31
  Bottom 0.381: IC5.9 81.28,27.22 81.28,38.91 77.46,42.73 N3.7
N$32
  Top 0.381: IC5.8 81.28,19.6 80.01,20.87 80.01,29.79 73.87,35.92 N3.6
N$33
  Bottom 0.381: IC5.7 78.74,15.96 78.19,15.41 78.19,6.81 79.38,5.63 IC19.15
N$34
  Bottom 0.381: IC19.1 81.92,13.25 80.1,15.06 80.1,18.75 79.25,19.6 76.2,19.6 IC5.6
N$35
  Top 0.381: IC19.2 79.38,13.25 72.74,13.25 71.12,14.87 IC5.4
N$36
  Bottom 0.381: IC5.3 68.58,15.96 70.61,13.93 76.15,13.93 76.83,13.25 IC19.3
N$37
  Bottom 0.381: IC4.7 60.35,15.85 67.58,15.85 70.19,13.25 74.3,13.25 IC19.4
N$38
  Bottom 0.381: IC19.5 71.75,9.61 68.7,9.61 67.94,10.37 67.94,12.46 65.87,14.53 59.87,14.53 58.43,15.96 55.88,15.96 IC4.6
N$39
  Top 0.381: IC4.4 50.8,19.6 58.94,19.6 59.8,18.73 59.8,16.64 61.26,15.19 67.28,15.19 69.22,13.25 IC19.6
N$40
  Top 0.381: IC4.3 48.26,17.4 51.68,13.98 65.94,13.98 66.67,13.25 IC19.7
N$41
  Top 0.381: IC6.2 86.36,19.6 87.74,20.98 87.74,33.06 91.23,36.54 N4.5
N$42
  Top 0.381: N4.4 88.61,37.68 85.09,34.16 85.09,20.87 83.82,19.6 IC6.1
N$43
  Bottom 0.381: N4.3 83.82,37.19 IC6.16
N$44
  Bottom 0.381: IC14.3 170.18,15.47 162.72,8.01 161.13,8.01 158.75,5.63 IC18.26
N$45
  Bottom 0.381: IC18.10 140.97,13.25 139.7,14.52 Y1.3
N$46
  Bottom 0.381: IC6.15 86.36,27.22 86.36,37.15 N4.2
N$47
  Bottom 0.381: IC18.9 143.51,13.25 144.78,14.52 Y1.1
N$48
  Bottom 0.381: IC6.14 88.9,27.22 87.62,28.5 N4.1
N$49
  Bottom 0.381: IC7.5 170.81,5.63 170.34,5.63 169.89,5.18 166.09,5.18 165.65,5.63 163.11,5.63 IC18.27
N$50
  Bottom 0.381: IC7.6 173.35,1.99 163.83,1.99 IC18.28
N$51
  Bottom 0.381: G1.+ 185.89,10.16 182.8,13.25 173.35,13.25 IC7.3
N$52
  Bottom 0.381: IC7.1 178.44,9.61 180.25,9.61 Q9.2
N$53
  Bottom 0.381: IC7.2 175.9,9.61 179.16,6.35 Q9.1
N$54
  Bottom 0.381: IC6.13 91.44,27.22 91.92,27.22 97.8,33.1 N4.0
N$55
  Bottom 0.381: IC6.11 96.52,27.22 99,29.7 99,37.2 N4.9
N$56
  Bottom 0.381: N4.8 100.03,38.76 100.03,28.19 99.06,27.22 IC6.10
N$57
  Top 0.381: IC18.1 163.83,9.61 152.29,9.61 151.59,8.92 124.96,8.92 121.28,12.6 114.08,12.6 112.92,11.43 R2.1
  Bottom 0.381: ISP1.5 R2.1
N$58
  Top 0.381: N4.7 96.81,37.68 101.6,32.89 IC6.9
N$59
  Top 0.381: IC6.8 101.6,19.6 100.33,20.87 100.33,30.39 94.19,36.52 N4.6
N$60
  Bottom 0.381: N5.5 111.55,39.86 106.77,35.08 106.77,28.63 107.85,27.54 107.85,20.77 106.68,19.6 IC8.2
N$61
  Bottom 0.381: IC8.1 104.14,19.6 105.35,20.81 105.35,37.56 106.35,38.56 107.22,38.56 108.92,40.27 N5.4
N$62
  Top 0.381: N5.3 104.14,37.19 IC8.16
N$63
  Bottom 0.381: IC8.15 106.68,27.22 106.08,27.82 106.08,36.55 N5.2
N$64
  Bottom 0.381: IC8.14 109.22,27.22 107.94,28.5 N5.1
N$65
  Bottom 0.381: IC8.13 111.76,27.22 112.24,27.22 118.12,33.1 N5.0
N$66
  Top 0.381: IC8.11 116.84,27.22 119.32,29.7 119.32,37.2 N5.9
N$67
  Bottom 0.381: IC8.10 119.38,27.22 120.35,28.19 120.35,38.76 N5.8
N$68
  Top 0.381: N5.7 118.06,42.73 121.92,38.87 IC8.9
N$69
  Bottom 0.381: IC8.8 121.92,19.6 118.68,22.84 117.08,22.84 115.67,24.24 115.67,27.62 119.32,31.27 119.32,35.38 114.51,40.2 N5.6
N$70
  Bottom 0.381: IC8.7 119.38,19.6 111.25,19.6 110.49,18.84 110.49,16.73 108.35,14.59 102.6,14.59 101.04,13.03 101.04,6.82 102.23,5.63 IC20.15
N$71
  Top 0.381: IC20.1 104.78,13.25 104.81,13.28 115.25,13.28 116.84,14.88 IC8.6
N$72
  Bottom 0.381: IC8.4 111.76,15.96 109.04,13.25 102.23,13.25 IC20.2
N$73
  Bottom 0.381: IC8.3 106.82,15.38 101.83,15.38 99.69,13.25 IC20.3
N$74
  Bottom 0.381: IC6.7 99.06,15.15 97.16,13.25 IC20.4
N$75
  Bottom 0.381: IC20.5 94.61,13.25 94.91,13.25 96.52,14.86 IC6.6
N$76
  Bottom 0.381: IC20.6 92.08,13.25 91.44,13.88 IC6.4
N$77
  Bottom 0.381: IC6.3 88.9,15.96 89.53,15.33 IC20.7
N$78
  Bottom 0.381: N9.5 192.83,39.86 188.05,35.08 188.05,28.63 189.13,27.54 189.13,20.77 187.96,19.6 IC9.2
N$79
  Bottom 0.381: IC9.1 185.42,19.6 184.26,20.75 184.26,37.73 189.27,42.73 N9.4
N$80
  Bottom 0.381: IC9.16 185.42,37.19 N9.3
N$81
  Bottom 0.381: IC9.15 187.96,27.22 187.36,27.82 187.36,36.55 N9.2
N$82
  Bottom 0.381: IC9.14 190.5,27.22 189.22,28.5 N9.1
N$83
  Bottom 0.381: IC9.13 193.04,27.22 193.5,27.22 199.4,33.12 N9.0
N$84
  Bottom 0.381: N9.9 200.6,37.2 200.6,29.7 198.12,27.22 IC9.11
N$85
  Bottom 0.381: N6.5 131.87,39.86 127.09,35.08 127.09,28.63 128.17,27.54 128.17,20.77 127,19.6 IC12.2
N$86
  Bottom 0.381: IC12.1 124.46,19.6 123.27,20.79 123.27,37.66 128.34,42.73 N6.4
N$87
  Bottom 0.381: IC12.16 124.46,37.19 N6.3
N$88
  Bottom 0.381: IC12.15 127,27.22 126.4,27.82 126.4,36.55 N6.2
N$89
  Bottom 0.381: IC12.14 129.54,27.22 128.26,28.5 N6.1
N$90
  Bottom 0.381: IC12.13 132.08,27.22 132.5,27.22 138.44,33.16 N6.0
N$91
  Top 0.381: IC12.11 137.16,27.22 139.66,29.71 139.66,37.19 N6.9
N$92
  Bottom 0.381: IC12.10 139.7,27.22 140.67,28.19 140.67,38.76 N6.8
N$93
  Bottom 0.381: N6.7 138.43,42.73 142.24,38.92 IC12.9
N$94
  Top 0.381: IC12.8 142.24,19.6 140.97,20.87 140.97,37.6 139.62,38.95 138.82,38.95 134.83,42.93 N6.6
N$95
  Top 0.381: IC13.2 147.32,19.6 148.7,20.98 148.7,33.06 152.19,36.54 N7.5
N$96
  Top 0.381: IC13.1 144.78,19.6 146.05,20.87 146.05,34.16 149.56,37.68 N7.4
N$97
  Bottom 0.381: IC13.16 144.78,37.19 N7.3
N$98
  Bottom 0.381: IC13.15 147.32,27.22 147.32,37.15 N7.2
N$99
  Bottom 0.381: IC13.14 149.86,27.22 148.58,28.5 N7.1
N$100
  Bottom 0.381: IC13.13 152.4,27.22 152.88,27.22 158.76,33.1 N7.0
N$101
  Bottom 0.381: N7.9 159.96,37.2 159.96,29.7 157.48,27.22 IC13.11
N$102
  Bottom 0.381: IC13.10 160.02,27.22 160.99,28.19 160.99,38.76 N7.8
N$103
  Top 0.381: N7.7 157.78,37.48 162.56,32.7 IC13.9
N$104
  Top 0.381: IC13.8 162.56,19.6 161.29,20.87 161.29,30.39 155.15,36.52 N7.6
N$105
  Top 0.381: IC14.2 167.64,19.6 169.02,20.98 169.02,33.06 172.51,36.54 N8.5
N$106
  Top 0.381: N8.4 169.88,37.68 166.37,34.16 166.37,20.87 165.1,19.6 IC14.1
N$107
  Bottom 0.381: IC14.16 165.1,37.19 N8.3
N$108
  Bottom 0.381: IC14.15 167.64,27.22 167.64,37.15 N8.2
N$109
  Bottom 0.381: IC14.14 170.18,27.22 168.9,28.5 N8.1
N$110
  Bottom 0.381: IC14.13 172.72,27.22 173.2,27.22 179.08,33.1 N8.0
N$111
  Bottom 0.381: N8.9 180.28,37.2 180.28,29.7 177.8,27.22 IC14.11
N$112
  Bottom 0.381: IC9.10 200.66,27.22 201.63,28.19 201.63,38.76 N9.8
N$113
  Top 0.381: N9.7 198.41,37.69 203.2,32.91 IC9.9
N$114
  Top 0.381: IC9.8 203.2,19.6 201.93,20.87 201.93,30.39 195.79,36.52 N9.6
N$115
  Top 0.381: IC10.2 208.28,19.6 209.66,20.98 209.66,33.06 213.15,36.54 N10.5
N$116
  Top 0.381: IC10.1 205.74,19.6 207.01,20.87 207.01,34.16 210.53,37.68 N10.4
N$117
  Bottom 0.381: N10.3 205.74,37.19 IC10.16
N$118
  Bottom 0.381: IC10.15 208.28,27.22 208.28,37.15 N10.2
N$119
  Bottom 0.381: IC10.14 210.82,27.22 209.54,28.5 N10.1
N$120
  Bottom 0.381: IC10.13 213.36,27.22 213.76,27.22 219.72,33.18 N10.0
N$121
  Bottom 0.381: N10.9 220.93,37.2 220.93,29.71 218.44,27.22 IC10.11
N$122
  Bottom 0.381: IC10.10 220.98,27.22 221.95,28.19 221.95,38.76 N10.8
N$123
  Top 0.381: N10.7 218.74,37.69 223.52,32.91 IC10.9
N$124
  Top 0.381: IC10.8 223.52,19.6 222.25,20.87 222.25,30.39 216.11,36.52 N10.6
N$125
  Bottom 0.381: IC10.7 220.98,15.96 221.51,15.43 221.51,6.79 220.34,5.63 IC21.15
N$126
  Top 0.381: IC21.1 222.88,13.25 221.16,13.25 218.44,15.96 IC10.6
N$127
  Bottom 0.381: IC10.4 213.36,19.6 218.92,19.6 219.82,18.69 219.82,13.77 220.34,13.25 IC21.2
N$128
  Top 0.381: IC21.3 215.15,14.08 214.13,14.08 210.82,17.4 IC10.3
N$129
  Top 0.381: IC9.7 200.66,15.96 210.73,15.96 IC21.4
N$130
  Top 0.381: IC9.6 198.12,15.96 199.25,14.83 209.32,14.83 IC21.5
N$131
  Bottom 0.381: IC9.4 193.04,19.6 198.6,19.6 199.39,18.81 199.39,16.75 202.21,13.93 209.5,13.93 210.19,13.25 IC21.6
N$132
  Top 0.381: IC9.3 190.5,15.96 193.22,13.25 207.65,13.25 IC21.7
N$133
  Top 0.381: IC11.2 228.6,19.6 229.98,20.98 229.98,33.06 233.47,36.54 N11.5
N$134
  Top 0.381: IC11.1 226.06,19.6 227.33,20.87 227.33,34.16 230.84,37.68 N11.4
N$135
  Bottom 0.381: IC11.16 226.06,37.19 N11.3
N$136
  Bottom 0.381: IC11.15 228.6,27.22 228.6,37.15 N11.2
N$137
  Bottom 0.381: IC11.14 231.14,27.22 229.86,28.5 N11.1
N$138
  Bottom 0.381: IC11.13 233.68,27.22 234.12,27.22 240.04,33.14 N11.0
N$139
  Top 0.381: N16.4 7.33,37.68 3.81,34.16 3.81,20.87 2.54,19.6 IC2.1
N$140
  Bottom 0.381: N16.3 2.54,37.19 IC2.16
N$141
  Bottom 0.381: IC2.15 5.08,27.22 5.08,37.15 N16.2
N$142
  Bottom 0.381: IC2.14 7.62,27.22 6.34,28.5 N16.1
N$143
  Bottom 0.381: IC2.13 10.16,27.22 10.64,27.22 16.52,33.1 N16.0
N$144
  Bottom 0.381: N16.9 17.74,37.19 17.74,30.68 15.24,28.19 15.24,27.22 IC2.11
N$145
  Bottom 0.381: N16.8 18.75,38.76 18.75,29.88 17.78,28.9 IC2.10
N$146
  Top 0.381: N16.7 15.54,37.68 20.32,32.89 IC2.9
N$147
  Bottom 0.381: N16.6 12.91,43.7 15.08,41.53 17.67,41.53 19.44,39.77 19.44,29.48 19.12,29.16 19.12,20.79 20.32,19.6 IC2.8
N$148
  Top 0.381: IC3.8 40.64,19.6 39.37,20.87 39.37,30.39 33.23,36.52 N1.6
N$149
  Bottom 0.381: IC3.7 38.1,15.96 48.85,15.96 50.89,13.93 56.31,13.93 57.73,12.51 57.73,8.87 56.52,7.66 IC1.15
N$150
  Bottom 0.381: N11.9 241.24,37.2 241.24,29.7 238.76,27.22 IC11.11
N$151
  Bottom 0.381: IC11.10 241.3,27.22 242.27,28.19 242.27,38.76 N11.8
N$152
  Top 0.381: N11.7 239.06,37.69 243.84,32.91 IC11.9
N$153
  Top 0.381: IC11.8 243.84,19.6 242.57,20.87 242.57,30.39 236.43,36.52 N11.6
N$154
  Bottom 0.381: N8.8 181.31,38.76 181.31,28.99 180.34,28.02 IC14.10
N$155
  Top 0.381: N8.7 178.09,37.68 182.88,32.89 IC14.9
N$156
  Bottom 0.381: N8.6 175.47,43.7 177.64,41.53 180.23,41.53 182,39.77 182,28.59 181.69,28.28 181.69,20.79 182.88,19.6 IC14.8
N$157
  Top 0.381: IC15.2 248.92,19.6 250.3,20.98 250.3,33.06 253.79,36.54 N12.5
N$158
  Top 0.381: IC15.1 246.38,19.6 247.65,20.87 247.65,34.16 251.16,37.68 N12.4
N$159
  Bottom 0.381: IC15.16 246.38,37.19 N12.3
N$160
  Bottom 0.381: IC15.15 248.92,27.22 248.92,37.15 N12.2
N$161
  Bottom 0.381: IC15.14 251.46,27.22 250.18,28.5 N12.1
N$162
  Bottom 0.381: IC15.13 254,27.22 254.42,27.22 260.36,33.16 N12.0
N$163
  Bottom 0.381: IC14.4 172.72,15.96 171.68,15.96 162.29,6.58 161.72,6.58 159.91,4.76 159.91,2.63 159.27,1.99 156.21,1.99 IC18.25
N$164
  Top 0.381: IC18.24 153.67,5.63 155.78,7.73 169.44,7.73 172.09,10.38 172.09,12.46 172.87,13.25 176.22,13.25 177.8,14.83 IC14.6
N$165
  Bottom 0.381: IC14.7 180.34,19.6 169.64,19.6 168.91,18.87 168.91,16.68 168.2,15.96 166.02,15.96 162.56,12.51 162.56,10.34 161.21,8.98 154.49,8.98 151.13,5.63 IC18.23
N$166
  Bottom 0.381: IC13.7 160.02,15.96 161.29,14.69 IC18.2
N$167
  Bottom 0.381: IC13.6 157.48,15.96 158.75,14.69 IC18.3
N$168
  Bottom 0.381: IC18.4 156.21,13.25 154.01,13.25 152.4,14.86 IC13.4
N$169
  Bottom 0.381: IC13.3 149.86,15.96 150.19,15.96 153.67,12.49 IC18.5
N$170
  Top 0.381: IC18.6 151.13,13.25 145.57,13.25 145.45,13.12 144.23,13.12 144.07,13.29 143.07,13.29 142.91,13.13 141.69,13.13 141.53,13.29 140.53,13.29 140.37,13.13 139.15,13.13 138.26,14.01 138.26,16.34 IC12.7
N$171
  Bottom 0.381: IC18.11 138.43,13.25 137.16,14.52 IC12.6
N$172
  Top 0.381: IC18.12 133.66,13.66 133.29,13.66 132.08,14.88 IC12.4
N$173
  Bottom 0.381: IC12.3 129.54,15.96 132.26,13.25 133.35,13.25 IC18.13
N$174
  Bottom 0.381: IC18.14 130.81,9.61 128.81,7.62 124.18,7.62 S2.1
N$175
  Bottom 0.381: N12.9 261.57,37.2 261.57,29.71 259.08,27.22 IC15.11
N$176
  Bottom 0.381: IC15.10 261.62,27.22 262.59,28.19 262.59,38.76 N12.8
N$177
  Top 0.381: N12.7 259.38,37.68 264.16,32.89 IC15.9
N$178
  Top 0.381: IC15.8 264.16,19.6 262.89,20.87 262.89,30.39 256.75,36.52 N12.6
N$179
  Bottom 0.381: IC22.15 243.21,5.63 245.2,7.62 248.72,7.62 249.49,8.39 249.49,12.42 251,13.93 258.2,13.93 261.62,17.36 IC15.7
N$180
  Top 0.381: IC22.1 245.75,13.25 249.23,13.25 252.73,16.75 252.73,18.82 253.51,19.61 257.25,19.61 IC15.6
N$181
  Bottom 0.381: IC22.2 243.21,13.25 245.24,15.28 253.31,15.28 254,15.96 IC15.4
N$182
  Bottom 0.381: IC22.3 240.66,13.25 243.38,15.96 251.46,15.96 IC15.3
N$183
  Bottom 0.381: IC22.4 238.12,11.68 241.3,14.85 IC11.7
N$184
  Bottom 0.381: IC22.5 235.59,13.25 237.17,13.25 238.76,14.83 IC11.6
N$185
  Bottom 0.381: IC11.4 233.68,15.96 233.04,15.33 IC22.6
N$186
  Bottom 0.381: IC11.3 231.14,15.96 230.5,15.33 IC22.7
N$187
  Bottom 0.381: N13.5 274.11,39.86 269.33,35.08 269.33,28.63 270.41,27.54 270.41,20.77 269.24,19.6 IC16.2
N$188
  Bottom 0.381: IC16.1 266.7,19.6 265.51,20.79 265.51,37.66 270.58,42.73 N13.4
N$189
  Bottom 0.381: IC16.16 266.7,37.19 N13.3
N$190
  Bottom 0.381: IC16.15 269.24,27.22 268.64,27.82 268.64,36.55 N13.2
N$191
  Bottom 0.381: N13.1 270.5,28.5 271.78,27.22 IC16.14
N$192
  Bottom 0.381: IC16.13 274.32,27.22 274.76,27.22 280.68,33.14 N13.0
N$193
  Top 0.381: IC16.11 279.4,27.22 281.9,29.71 281.9,37.19 N13.9
N$194
  Bottom 0.381: IC16.10 281.94,27.22 282.91,28.19 282.91,38.76 N13.8
N$195
  Top 0.381: N13.7 280.62,42.73 284.48,38.87 IC16.9
N$196
  Bottom 0.381: IC16.8 284.48,19.6 282.83,19.6 278.22,24.21 278.22,29.41 281.88,33.08 281.88,35.38 277.07,40.2 N13.6
N$197
  Bottom 0.381: IC17.2 289.56,19.6 293.26,23.3 293.26,30.72 291.86,32.12 291.86,33.97 294.43,36.54 N14.5
N$198
  Bottom 0.381: IC17.1 287.02,19.6 285.83,20.79 285.83,37.66 290.9,42.73 N14.4
N$199
  Bottom 0.381: N14.3 287.02,37.19 IC17.16
N$200
  Bottom 0.381: IC17.15 289.56,27.22 289.56,37.15 N14.2
N$201
  Bottom 0.381: IC17.14 292.1,27.22 290.82,28.5 N14.1
N$202
  Bottom 0.381: IC17.13 294.64,27.22 295.12,27.22 301,33.1 N14.0
N$203
  Bottom 0.381: IC17.11 299.72,27.22 302.23,29.73 302.23,37.18 N14.9
N$204
  Bottom 0.381: IC17.10 302.26,27.22 303.23,28.19 303.23,38.76 N14.8
N$205
  Top 0.381: N14.7 300.01,37.69 304.8,32.91 IC17.9
N$206
  Top 0.381: IC17.8 304.8,19.6 303.53,20.87 303.53,30.39 297.39,36.52 N14.6
N$207
  Top 0.381: IC17.7 302.26,15.96 292.49,6.19 273.93,6.19 269.73,1.99 266.06,1.99 IC23.15
N$208
  Top 0.381: IC23.1 269.74,12.56 297.45,12.56 299.72,14.83 IC17.6
N$209
  Top 0.381: IC17.4 294.64,15.96 291.92,13.25 266.06,13.25 IC23.2
N$210  (via drill 0.61 pad 1.02)
  Top 0.381: IC23.3 263.52,9.61 265.41,7.72 281.49,7.72 v284.74,10.97
  Bottom 0.381: IC17.3 292.1,15.96 287.11,10.97 v284.74,10.97
N$211
  Top 0.381: IC16.7 281.94,15.96 279.91,13.93 261.67,13.93 260.99,13.25 IC23.4
N$212
  Bottom 0.381: IC16.6 279.4,19.6 273.82,19.6 273.05,18.82 273.05,16.24 272.01,15.2 262.21,15.2 IC23.5
N$213
  Bottom 0.381: IC16.4 274.32,15.96 272.33,13.98 263.77,13.98 262.25,12.46 262.25,10.34 261.52,9.61 255.91,9.61 IC23.6
N$214
  Bottom 0.381: IC16.3 271.78,15.96 261.2,15.96 258.48,13.25 253.37,13.25 IC23.7
N$215
  Top 0.381: IC1.1 59.05,13.25 50.48,13.25 47.77,15.96 35.56,15.96 IC3.6
N$216
  Bottom 0.381: IC3.4 30.48,14.87 31.27,14.08 34.91,14.08 35.46,14.64 47.91,14.64 49.3,13.25 54.7,13.25 IC1.2
N$217
  Bottom 0.381: IC1.3 53.98,9.61 48.4,9.61 47.62,10.39 47.62,13.01 46.7,13.93 36.07,13.93 35.47,13.33 30.57,13.33 27.94,15.96 IC3.3
N$218
  Top 0.381: IC1.4 51.33,11.43 48.83,13.93 19.81,13.93 17.78,15.96 IC2.7
N$219
  Top 0.381: IC1.5 47.08,13.25 17.96,13.25 15.24,15.96 IC2.6
N$220
  Bottom 0.381: IC2.4 10.16,14.85 12.36,12.65 35.76,12.65 36.36,13.25 46.35,13.25 IC1.6
N$221
  Bottom 0.381: IC1.7 43.81,9.61 39.65,9.61 37.7,11.57 12.01,11.57 7.62,15.96 IC2.3
N$222
  Top 0.381: JP2.1 274.15,3.81 270.95,0.61 31.61,0.61 27.3,4.92 JP1.1
  Bottom 0.381: JP1.1 24.93,6.35 24.42,5.84 C10.+ 18.17,5.84 17.41,5.08 IC24.1 11.16,5.08 J2.PWR
N$223
  Top 0.381: IC1.9 41.27,5.63 43.2,7.55 64.19,7.55 64.61,7.14 75.33,7.14 76.83,5.63 IC19.14
N$224
  Bottom 0.381: IC19.9 64.14,1.99 64.82,1.31 99.01,1.31 99.69,1.99 IC20.14
N$225
  Top 0.381: IC20.9 87,1.99 87.68,1.31 217.12,1.31 217.81,1.99 IC21.14
N$226
  Top 0.381: IC21.9 205.1,5.63 223.36,5.63 227,1.99 240.66,1.99 IC22.14
N$227
  Bottom 0.381: IC22.9 227.97,1.99 229.34,0.62 262.15,0.62 263.52,1.99 IC23.14
N$228
  Top 0.381: IC18.19 140.97,5.63 139.45,7.15 120.45,7.15 117.39,10.2 115.61,10.2 ISP1.3 112.99,10.2 106.75,10.2 104.74,8.2 94.65,8.2 92.08,5.63 | 69.22,1.99 69.9,1.31 82.14,1.31 86.45,5.63 92.08,5.63 | 69.22,1.99 68.53,1.31 47.04,1.31 46.35,1.99 IC1.11 | 92.08,5.63 IC20.11 | 69.22,1.99 IC19.11
  Bottom 0.381: 210.19,1.99 209.49,1.3 141.66,1.3 140.97,1.99 IC18.19 | 210.19,1.99 211.59,0.59 223,0.59 226.12,3.72 226.12,4.26 227.49,5.63 233.04,5.63 IC22.11 233.04,1.99 233.73,1.31 255.22,1.31 255.91,1.99 IC23.11 | 210.19,1.99 IC21.11
N$229
  Top 0.381: IC21.12 212.72,1.99 137.87,1.99 137.16,2.71 137.16,4.9 136.43,5.63 130.81,5.63 IC18.15 130.81,1.99 94.61,1.99 IC20.12 | IC1.12 48.9,1.99 59.98,1.99 63.61,5.63 71.75,5.63 IC19.12
  Bottom 0.381: IC21.12 212.72,1.99 213.44,1.28 222.68,1.28 224.98,3.58 224.98,4.09 227.22,6.33 234.88,6.33 235.59,5.63 IC22.12 235.59,3.69 235.59,1.99 246.67,1.99 250.3,5.63 258.44,5.63 IC23.12 | IC19.12 71.75,1.99 94.61,1.99 IC20.12
N$230
  Bottom 0.813: R1.1 8.89,49.53 11.43,46.99 N16.A
N$231
  Bottom 0.813: R3.1 29.21,49.53 31.75,46.99 N1.A
N$232
  Bottom 0.813: R4.1 49.53,49.53 52.07,46.99 N2.A
N$233
  Bottom 0.813: R5.1 69.85,49.53 72.39,46.99 N3.A
N$234
  Bottom 0.813: R6.1 90.17,49.53 92.71,46.99 N4.A
N$235
  Bottom 0.813: R7.1 110.49,49.53 113.03,46.99 N5.A
N$236
  Bottom 0.813: R8.1 293.37,49.53 295.91,46.99 N14.A
N$237
  Bottom 0.813: R9.1 273.05,49.53 275.59,46.99 N13.A
N$238
  Bottom 0.813: R10.1 252.73,49.53 255.27,46.99 N12.A
N$239
  Bottom 0.813: R11.1 232.41,49.53 234.95,46.99 N11.A
N$240
  Bottom 0.813: R12.1 212.09,49.53 214.63,46.99 214.63,33.02 N10.A
N$241
  Bottom 0.813: R13.1 191.77,49.53 194.31,46.99 N9.A
N$242
  Bottom 0.813: R14.1 130.81,49.53 133.35,46.99 N6.A
N$243
  Bottom 0.813: R15.1 151.13,49.53 153.67,46.99 N7.A
N$244
  Bottom 0.813: R16.1 171.45,49.53 173.99,46.99 N8.A
N$245
  Bottom 1.016: JP5.1 306.7,13.34 306.7,44.45 306.7,48.9 303.53,52.07 302.26,52.07 | 220.98,52.07 241.3,52.07 | 241.3,52.07 261.62,52.07 | 261.62,52.07 281.94,52.07 | 281.94,52.07 302.26,52.07 | 220.98,52.07 200.66,52.07 | 200.66,52.07 180.34,52.07 | 180.34,52.07 160.02,52.07 | 160.02,52.07 139.7,52.07 | 139.7,52.07 119.38,52.07 | 119.38,52.07 99.06,52.07 | 99.06,52.07 78.74,52.07 | 78.74,52.07 58.42,52.07 | 58.42,52.07 38.1,52.07 | 38.1,52.07 20.32,52.07 R1.2 | 38.1,52.07 R3.2 | 58.42,52.07 R4.2 | 78.74,52.07 R5.2 | 99.06,52.07 R6.2 | 119.38,52.07 R7.2 | 139.7,52.07 R14.2 | 160.02,52.07 R15.2 | 180.34,52.07 R16.2 | 200.66,52.07 R13.2 | R12.2 220.98,52.07 | 241.3,52.07 R11.2 | 261.62,52.07 R10.2 | 281.94,52.07 R9.2 | 302.26,52.07 R8.2
VCC  (via drill 0.61 pad 1.02)
  Top 0.381: IC13.5 154.94,15.96 155.63,15.27 155.63,15.24 | 155.63,15.24 155.05,15.24 155.05,14.97 154.16,14.08 151.54,14.08 151.02,14.61 C4.1 | 155.63,15.24 C15.1 157.37,15.24 158.54,14.07 174.47,14.07 175.37,14.97 175.37,15.24 175.95,15.24 | IC5.5 73.66,19.6 70.58,19.6 69.96,18.97 69.96,15.06 70.42,14.6 70.42,10.29 68.26,8.14 v65.03,8.14 | IC1.10 43.81,5.63 59.05,5.63 | 59.05,5.63 IC1.16 | C25.1 61.59,5.19 59.97,5.19 59.53,5.63 59.05,5.63 | C1.1 33.13,15.24 33.13,15.85 33.02,15.96 IC3.5 33.02,18.14 33.02,19.6 12.7,19.6 IC2.5 | 239.29,7.97 232.85,7.97 230.5,5.63 | 239.29,7.97 239.29,12.57 237.78,14.08 237.49,14.08 C5.1 | 245.75,5.99 243.76,7.97 239.29,7.97 | C8.1 229.78,6.35 230.5,5.63 | 230.5,5.63 IC22.10 | C21.1 297.87,15.24 297.87,15.27 297.18,15.96 IC17.5 297.18,19.6 276.86,19.6 IC16.5 | 245.75,5.99 246.77,5.99 247.13,6.35 C9.1 252.64,6.35 253.37,5.63 | 245.75,5.99 245.75,5.63 IC22.16 | C13.1 114.41,15.24 114.41,14.95 113.55,14.08 97.56,14.08 96.41,15.24 C12.1 94.67,15.24 | 85.61,12.37 85.61,8.4 84.72,7.51 84.45,7.51 C23.1 84.09,6.35 83.3,6.35 82.58,5.63 81.92,5.63 IC19.16 | 85.61,12.37 86.67,13.43 92.55,13.43 94.09,14.97 94.09,15.24 94.67,15.24 | 85.61,12.37 82.74,15.24 76.09,15.24 C11.1 | IC18.7 148.59,9.61 137.92,9.61 137.05,10.49 137.05,12.93 135.89,14.08 C14.1 134.73,15.24 134.73,15.85 134.62,15.96 IC12.5 | IC6.5 93.98,15.96 94.67,15.27 94.67,15.24 | C3.1 269.99,6.35 269.26,5.63 268.61,5.63 | 257.18,9.44 260.98,5.63 268.61,5.63 | C24.1 108.47,6.35 109.78,5.04 115.53,5.04 ISP1.2 | 257.18,9.44 257.18,13.45 257.81,14.08 C19.1 | 253.37,5.63 257.18,9.44 | 268.61,5.63 IC23.16
  Top 0.381: 253.37,5.63 IC23.10 | 181.51,19.6 175.26,19.6 IC14.5 175.26,15.96 175.95,15.27 175.95,15.24 | 181.51,19.6 195.58,19.6 IC9.5 | 181.51,19.6 181.51,11.3 178.44,8.23 178.44,5.63 | C7.1 168.8,6.35 169.52,5.63 178.44,5.63 | 178.44,5.63 IC7.8 | 175.95,15.24 C16.1 | C22.1 13.97,14.08 15.24,12.81 IC24.3
  Bottom 0.381: 216.61,1.96 221.04,1.96 IC21.16 222.88,5.63 223.54,5.63 224.27,6.35 C8.1 | 207.65,5.63 213.28,5.63 214,4.91 214,2.72 214.75,1.96 216.61,1.96 | 216.61,1.96 216.61,13.53 217.17,14.08 C18.1 217.17,16.51 IC10.5 | 207.65,5.63 207.65,5.46 IC21.10 | 207.65,5.63 207.62,5.63 198.01,15.24 C17.1 195.69,15.24 195.69,15.85 195.58,15.96 IC9.5 | 116.84,12.87 124.43,12.87 128.37,16.81 128.37,18.91 129.06,19.6 134.62,19.6 IC12.5 | 116.84,12.87 115.63,14.08 115.57,14.08 C13.1 114.41,15.24 114.41,15.85 114.3,15.96 IC8.5 | 116.84,12.87 116.84,12.59 R2.2 116.84,10.27 117.32,10.27 118.15,9.44 118.15,7.66 ISP1.2 | 64.82,7.49 63.89,7.49 | 64.82,7.49 66.67,5.63 IC19.10 | v65.03,8.14 64.82,7.93 64.82,7.49 | C11.1 74.93,16.4 73.66,17.67 IC5.5 | 63.89,7.49 62.75,8.62 62.75,10.05 57.56,15.24 C6.1 53.45,15.24 53.45,15.85 53.34,15.96 IC4.5 | C3.1 274.76,6.35 277.28,8.87 277.28,14.94 276.97,15.24 | C5.1 236.33,15.24 236.33,15.85 236.22,15.96 IC11.5 | IC1.10 43.81,5.63 40.72,5.63 40.28,5.19 38.25,5.19 37.48,5.95 37.48,6.75 | 37.48,6.75 38.47,7.73 38.73,7.73 C2.1 | 37.48,6.75 35.66,6.75 C26.+ 31.71,10.71 17.96,10.71 17.41,10.16 IC24.3 | 63.89,7.49 62.75,6.35 C25.1 | C22.1 13.97,16.4 12.7,17.67 IC2.5 | C19.1 257.81,16.4 256.54,17.67 IC15.5 | C24.1 106.16,6.35 105.44,5.63 104.78,5.63 IC20.16 | C23.1 85.61,6.35 86.33,5.63 89.53,5.63 IC20.10 | IC18.7 148.59,13.25 149.66,13.25 149.86,13.45 C4.1 | 276.97,15.24 C20.1 | IC16.5 276.86,15.96 276.97,15.85 276.97,15.24